# Altium schematic sheet peripherals-headers.SchDoc
size A; SheetNumber: 1; SheetTotal: 1
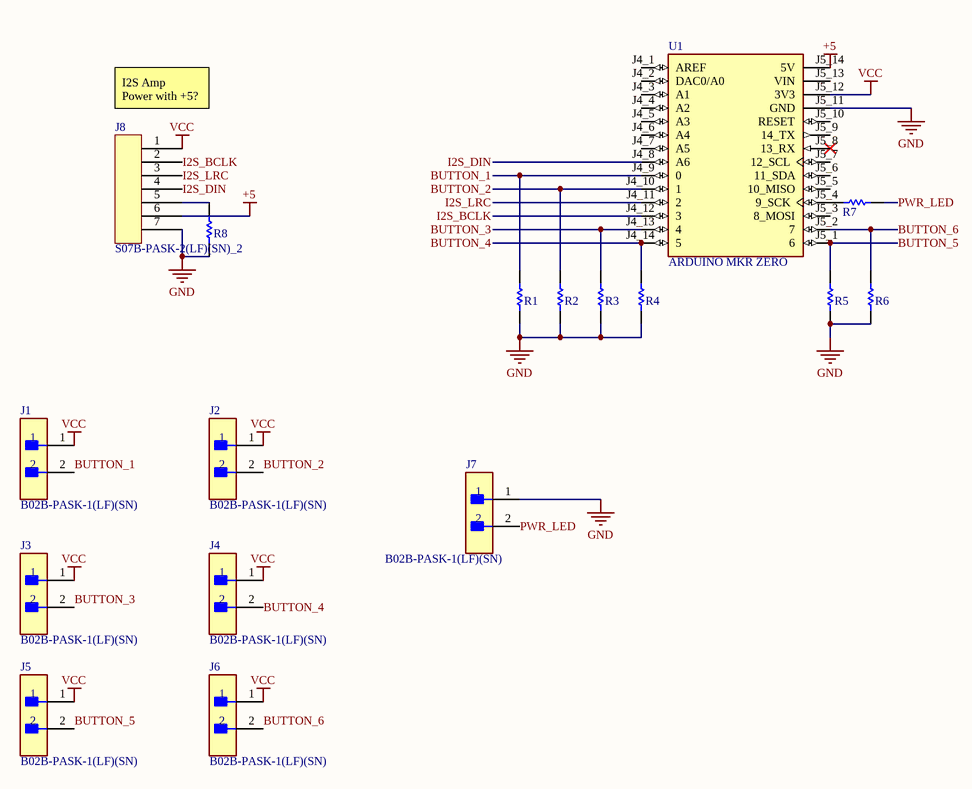
[diagram p0: peripherals-headers.SchDoc]

## Parts
J1  B02B-PASK-1(LF)(SN)  [FP-B02B-PASK-1_LF_SN-MFG]
J2  B02B-PASK-1(LF)(SN)  [FP-B02B-PASK-1_LF_SN-MFG]
J3  B02B-PASK-1(LF)(SN)  [FP-B02B-PASK-1_LF_SN-MFG]
J4  B02B-PASK-1(LF)(SN)  [FP-B02B-PASK-1_LF_SN-MFG]
J5  B02B-PASK-1(LF)(SN)  [FP-B02B-PASK-1_LF_SN-MFG]
J6  B02B-PASK-1(LF)(SN)  [FP-B02B-PASK-1_LF_SN-MFG]
J7  B02B-PASK-1(LF)(SN)  [FP-B02B-PASK-1_LF_SN-MFG]
J8  S07B-PASK-2(LF)(SN)_2  [S07B-PASK-2(LF)(SN)_2-Footprint-1]
R1  1k Through-Hole 1/4W  [RESA60-630X240]  (value not drawn)
R2  1k Through-Hole 1/4W  [RESA60-630X240]  (value not drawn)
R3  1k Through-Hole 1/4W  [RESA60-630X240]  (value not drawn)
R4  1k Through-Hole 1/4W  [RESA60-630X240]  (value not drawn)
R5  1k Through-Hole 1/4W  [RESA60-630X240]  (value not drawn)
R6  1k Through-Hole 1/4W  [RESA60-630X240]  (value not drawn)
R7  1k Through-Hole 1/4W  [RESA60-630X240]  (value not drawn)
R8  1k Through-Hole 1/4W  [RESA60-630X240]  (value not drawn)
U1  ARDUINO MKR ZERO  [ARDUINO MKR ZERO-Footprint-1]

## Nets
+5: J8.6 U1.J5_14(5V)
GND: J7.1 J8.7 R1.1 R2.1 R3.1 R4.1 R5.1 R6.1 R8.1 U1.J5_11(GND)
VCC: J1.1 J2.1 J3.1 J4.1 J5.1 J6.1 J8.1 U1.J5_12(3V3)
BUTTON_1: J1.2 R1.2 U1.J4_9(0)
BUTTON_2: J2.2 R2.2 U1.J4_10(1)
BUTTON_3: J3.2 R3.2 U1.J4_13(4)
BUTTON_4: J4.2 R4.2 U1.J4_14(5)
BUTTON_5: J5.2 R5.2 U1.J5_1(6)
BUTTON_6: J6.2 R6.2 U1.J5_2(7)
I2S_BCLK: J8.2 U1.J4_12(3)
I2S_DIN: J8.4 U1.J4_8(A6)
I2S_LRC: J8.3 U1.J4_11(2)
PWR_LED: J7.2 R7.1
NetJ8_5: J8.5 R8.2
NetR7_2: R7.2 U1.J5_4(9_SCK)

Not connected (* = marked no-connect by the designer): U1 J4_1(AREF) J4_2(DAC0/A0) J4_3(A1) J4_4(A2) J4_5(A3) J4_6(A4) J4_7(A5) J5_3(8_MOSI) J5_5(10_MISO) J5_6(11_SDA) J5_7(12_SCL) J5_8(13_RX)* J5_9(14_TX) J5_10(RESET) J5_13(VIN)

## Notes on the sheet
- (near J8) I2S Amp
  Power with +5?

## Library data of the parts
J1-J7 = CMP-17439-000415-1: CONN HEADER VERT 2POS 2MM; Number of Contacts: 2; Current Rating: 3A; Insulation Resistance: 1GR; Mated Stacking Heights: 14.9mm; Voltage Rating: 250V; Gender: Male; Pitch: 2mm; Orientation: Straight; Contact Finish - Mating: TIN; Mount: Through Hole; Contact Type: Male Pin; Number of Rows: 1; Fastening Type: Ramp; Series: PA; Connector Type: Header; Insulation Color: Natural; Flammability Rating: UL94 V-0; Material: Polybutylene; Contact Shape: Square; Contact Plating: Tin; Insulation Material: PBT; Max Operating Temperature: 85°C; Housing Color: White; Number of Positions: 2; Contact Material: Copper Alloy; Min Operating Temperature: -25°C; Lead Free: Lead Free; Contact Mating Length: 0.126inch; Termination: Solder; Packaging: Bulk; Color: Natural
J8 = CMP-002-00095-1: Conn Shrouded Header HDR 7 POS 2mm Solder RA Thru-Hole Box
R1-R8 = CMP-009-00195-1: RES 1K OHM 1/4W 1% AXIAL; Resistance: 1kR; Voltage Rating (DC): 200V; Temperature Coefficient: 100ppm/°C; Lead Diameter: 0.6mm; Max Power Dissipation: 250mW; Voltage Rating: 250V; Min Operating Temperature: -55°C; Max Operating Temperature: 155°C; Case/Package: Axial; Series: MFR; Tolerance: 1%; Lead Free: Lead Free; Packaging: Bulk; Length: 0.248inch; Mount: Through Hole; Width: 6.3mm; Termination: Axial; RoHS Compliant: Yes; Package Quantity: 200; Number of Terminations: 2; Power Rating: 250mW; Resistor Type: Metal Film
U1 = CMP-001-0003-1: SEN PHT LO/DO M8 4PIN NO BRKT